# EAGLE design bib (EAGLE 7.0.0)
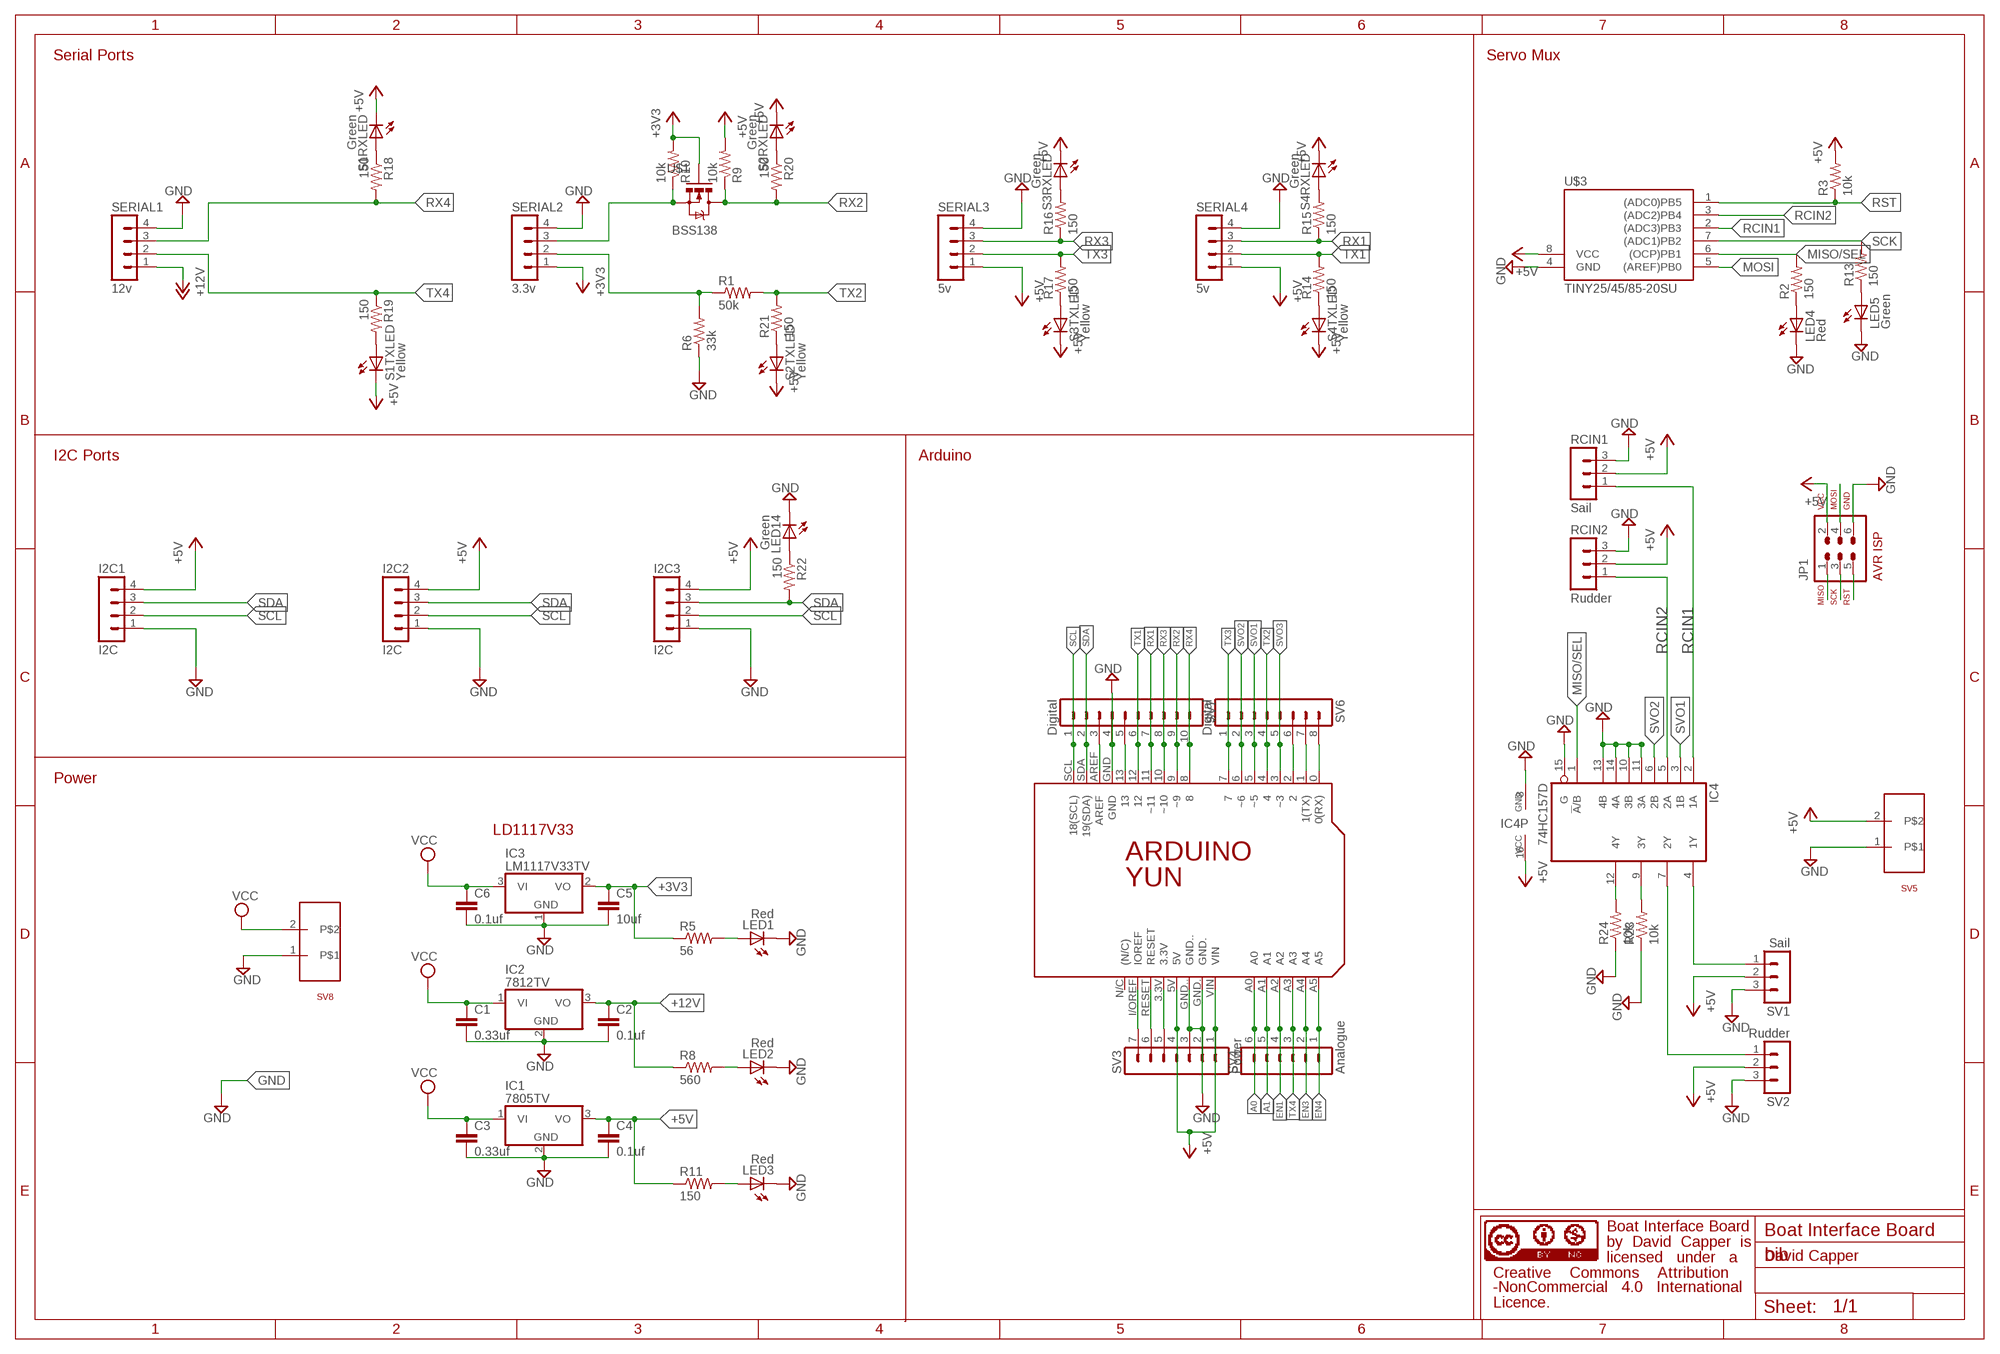
[diagram p0: schematic, sheet 1]

## Parts
C1  0.33uf  C-EUC0805K  [C0805K]
C2  0.1uf  C-EUC0805K  [C0805K]
C3  0.33uf  C-EUC0805K  [C0805K]
C4  0.1uf  C-EUC0805K  [C0805K]
C5  10uf  C-EUC0805K  [C0805K]
C6  0.1uf  C-EUC0805K  [C0805K]
I2C1  I2C  MA04-1  [MA04-1]
I2C2  I2C  MA04-1  [MA04-1]
I2C3  I2C  MA04-1  [MA04-1]
IC1  7805TV  [TO220V]
IC2  7812TV  [TO220V]
IC3  LM1117V33TV  [TO220V]
IC4  74HC157D  [SO16]
JP1  AVR-ISP-6VERT  [AVR-ISP-6]
LED1  Red  LEDSML1206  [SML1206]
LED2  Red  LEDSML1206  [SML1206]
LED3  Red  LEDSML1206  [SML1206]
LED4  Red  LEDSML1206  [SML1206]
LED5  Green  LEDSML1206  [SML1206]
LED14  Green  LEDSML1206  [SML1206]
PCB2  ARDUINO_YUNARDUINO_YUN  [ARDUINO_YUN]
R1  50k  R-US_M0805  [M0805]
R2  150  R-US_R0805  [R0805]
R3  10k  R-US_R0805  [R0805]
R5  56  R-US_R0805  [R0805]
R6  33k  R-US_M0805  [M0805]
R8  560  R-US_R0805  [R0805]
R9  10k  R-US_M0805  [M0805]
R10  10k  R-US_M0805  [M0805]
R11  150  R-US_R0805  [R0805]
R13  150  R-US_R0805  [R0805]
R14  150  R-US_R0805  [R0805]
R15  150  R-US_R0805  [R0805]
R16  150  R-US_R0805  [R0805]
R17  150  R-US_R0805  [R0805]
R18  150  R-US_R0805  [R0805]
R19  150  R-US_R0805  [R0805]
R20  150  R-US_R0805  [R0805]
R21  150  R-US_R0805  [R0805]
R22  150  R-US_R0805  [R0805]
R23  10k  R-US_R0805  [R0805]
R24  10k  R-US_R0805  [R0805]
RCIN1  Sail  MA03-1  [MA03-1]
RCIN2  Rudder  MA03-1  [MA03-1]
S1RXLED  Green  LEDSML1206  [SML1206]
S1TXLED  Yellow  LEDSML1206  [SML1206]
S2RXLED  Green  LEDSML1206  [SML1206]
S2TXLED  Yellow  LEDSML1206  [SML1206]
S3RXLED  Green  LEDSML1206  [SML1206]
S3TXLED  Yellow  LEDSML1206  [SML1206]
S4RXLED  Green  LEDSML1206  [SML1206]
S4TXLED  Yellow  LEDSML1206  [SML1206]
SERIAL1  12v  MA04-1  [MA04-1]
SERIAL2  3.3v  MA04-1  [MA04-1]
SERIAL3  5v  MA04-1  [MA04-1]
SERIAL4  5v  MA04-1  [MA04-1]
SV1  Sail  MA03-1  [MA03-1]
SV2  Rudder  MA03-1  [MA03-1]
SV3  Power  MA07-1  [MA07-1]
SV4  Analogue  MA06-1  [MA06-1]
SV5  MA02  [MA02-1]
SV6  Digital  MA08-1  [MA08-1]
SV7  Digital  MA10-1  [MA10-1]
SV8  MA02  [MA02-1]
U$1  BSS138  [SOT23]
U$3  TINY25/45/85-20SU  [SOIC8]

## Nets
+3V3: C5.1 IC3.2(VO) R5.1 R10.2 SERIAL2.1 U$1.1(G)
+5V: C4.1 I2C1.4 I2C2.4 I2C3.4 IC1.3(VO) IC4.16(VCC) JP1.2 PCB2.5V PCB2.VIN R3.2 R9.2 R11.1 RCIN1.2 RCIN2.2 S1RXLED.C S1TXLED.C S2RXLED.C S2TXLED.C S3RXLED.C S3TXLED.C S4RXLED.C S4TXLED.C SERIAL3.1 SERIAL4.1 SV1.2 SV2.2 SV3.1 SV3.4 SV5.2 U$3.8(VCC)
+12V: C2.1 IC2.3(VO) R8.1 SERIAL1.1
A0: PCB2.A0 SV4.6
A1: PCB2.A1 SV4.5
EN1: PCB2.A2 SV4.4
EN3: PCB2.A4 SV4.2
EN4: PCB2.A5 SV4.1
GND: C1.2 C2.2 C3.2 C4.2 C5.2 C6.2 I2C1.1 I2C2.1 I2C3.1 IC1.2(GND) IC2.2(GND) IC3.1(GND) IC4.8(GND) IC4.10(3B) IC4.11(3A) IC4.13(4B) IC4.14(4A) IC4.15(G) JP1.6 LED1.C LED2.C LED3.C LED4.C LED5.C LED14.C PCB2.GND PCB2.GND. PCB2.GND.. R6.1 R23.1 R24.1 RCIN1.3 RCIN2.3 SERIAL1.4 SERIAL2.4 SERIAL3.4 SERIAL4.4 SV1.3 SV2.3 SV3.2 SV3.3 SV5.1 SV7.4 SV8.1 U$3.4(GND)
MEH: PCB2.2 SV6.6
MISO/SEL: IC4.1(!A!/B) JP1.1 R2.2 U$3.6((OCP)PB1)
MOSI: JP1.4 U$3.5((AREF)PB0)
N$1: R10.1 SERIAL2.3 U$1.2(S)
N$2: LED4.A R2.1
N$3: IC4.12(4Y) R24.2
N$5: R1.1 R6.2 SERIAL2.2
N$7: IC4.4(1Y) SV1.1
N$8: IC4.7(2Y) SV2.1
N$9: PCB2.3.3V SV3.5
N$11: PCB2.RESET SV3.6
N$12: PCB2.I/OREF(IOREF) SV3.7
N$13: PCB2.1(1(TX)) SV6.7
N$14: PCB2.0(0(RX)) SV6.8
N$15: PCB2.AREF SV7.3
N$17: PCB2.13 SV7.5
N$20: IC4.9(3Y) R23.2
N$21: LED1.A R5.2
N$22: LED2.A R8.2
N$23: LED3.A R11.2
N$24: R18.1 S1RXLED.A
N$25: R19.2 S1TXLED.A
N$26: R20.1 S2RXLED.A
N$27: R21.1 S2TXLED.A
N$28: LED14.A R22.1
N$29: R15.2 S4RXLED.A
N$30: R14.1 S4TXLED.A
N$31: R16.2 S3RXLED.A
N$32: R17.1 S3TXLED.A
N$34: LED5.A R13.1
RCIN1: IC4.2(1A) RCIN1.1 U$3.2((ADC3)PB3)
RCIN2: IC4.5(2A) RCIN2.1 U$3.3((ADC2)PB4)
RST: JP1.5 R3.1 U$3.1((ADC0)PB5)
RX1: PCB2.11(~11) R15.1 SERIAL4.3 SV7.7
RX2: PCB2.9(~9) R9.1 R20.2 SV7.9 U$1.3(D)
RX3: PCB2.10(~10) R16.1 SERIAL3.3 SV7.8
RX4: PCB2.8 R18.2 SERIAL1.3 SV7.10
SCK: JP1.3 R13.2 U$3.7((ADC1)PB2)
SCL: I2C1.2 I2C2.2 I2C3.2 PCB2.SCL(18(SCL)) SV7.1
SDA: I2C1.3 I2C2.3 I2C3.3 PCB2.SDA(19(SDA)) R22.2 SV7.2
SVO1: IC4.3(1B) PCB2.5(~5) SV6.3
SVO2: IC4.6(2B) PCB2.6(~6) SV6.2
SVO3: PCB2.3(~3) SV6.5
TX1: PCB2.12 R14.2 SERIAL4.2 SV7.6
TX2: PCB2.4 R1.2 R21.2 SV6.4
TX3: PCB2.7 R17.2 SERIAL3.2 SV6.1
TX4: PCB2.A3 R19.1 SERIAL1.2 SV4.3
VCC: C1.1 C3.1 C6.1 IC1.1(VI) IC2.1(VI) IC3.3(VI) SV8.2
Unconnected: PCB2.N/C((N/C))

## Notes on the sheet
- Serial Ports | Servo Mux
- I2C Ports | Arduino
- Power
- LD1117V33
- Boat Interface Board
- Boat Interface Board
- by  David  Capper  is
- licensed   under   a | David Capper
- Creative    Commons    Attribution
- -NonCommercial   4.0   International
- Licence.

## Library data of the parts
C1 C3 = resistor:C-EU: CAPACITOR, European symbol; MF: AVX; MPN: 08053C334KAT2A; OC_FARNELL: 1833878
C2 C4 C6 = resistor:C-EU: CAPACITOR, European symbol; MF: AVX; MPN: 08051C104JAT2A; OC_FARNELL: 2332715RL
C5 = resistor:C-EU: CAPACITOR, European symbol; MF: YAGEO (PHYCOMP); MPN: CC0805KRX7R8BB333; OC_FARNELL: 3019822
I2C1-I2C3 SERIAL1-SERIAL4 = my_lib:MA04-1: PIN HEADER; OC_FARNELL: unknown; OC_NEWARK: unknown
IC1 = linear:78*: Positive VOLTAGE REGULATOR Source: http://cache.national.com/ds/LM/LM78L05.pdf http://www.fairchildsemi.com/ds/LM/LM7805.pdf; MF: STMICROELECTRONICS; MPN: L7805ACV; OC_FARNELL: 1087086
IC2 = linear:78*: Positive VOLTAGE REGULATOR Source: http://cache.national.com/ds/LM/LM78L05.pdf http://www.fairchildsemi.com/ds/LM/LM7805.pdf; MF: STMICROELECTRONICS; MPN: L7812ACV; OC_FARNELL: 1087091
IC3 = my_lib:LM1117V33: Positive VOLTAGE REGULATOR Source: http://cache.national.com/ds/LM/LM78L05.pdf http://www.fairchildsemi.com/ds/LM/LM7805.pdf; MF: STMICROELECTRONICS; MPN: LD1117V33; OC_FARNELL: 9755837
IC4 = my_lib:74*157: Quadruple 2-line to 1-line data SELECTOR/MULTIPLEXER; MF: TEXAS INSTRUMENTS; MPN: SN74HC157D; OC_FARNELL: 9591150
JP1 = avr-7:AVR-ISP-6: AVR ISP-6 Serial Programming Header
LED1-LED3 = led:LED: LED OSRAM: - CHIPLED LG R971, LG N971, LY N971, LG Q971, LY Q971, LO R971, LY R971 LH N974, LH R974 LS Q976, LO Q976, LY Q976 LO Q996 - Hyper CHIPLED LW Q18S LB Q993, LB Q99A, LB R99A - SideLED LS A670, LO A670, LY A670, LG A670, LP A670 LB A673, LV A673, LT A673, LW A673 LH A674 LY A675 LS A676, LA A676, LO A676, LY A676, LW A676 LS A679, LY A679, LG A679 - Hyper Micro SIDELED® LS Y876, LA Y876, LO Y876, LY Y876 LT Y87S - SmartLED LW L88C, LW L88S LB L89C, LB L89S, LG L890 LS L89K, LO L89K, LY L89K LS L896, LA L896, LO L896, LY L896 - TOPLED LS T670, LO T670, LY T670, LG T670, LP T670 LSG T670, LSP T670, LSY T670, LOP T670, LYG T670 LG T671, LOG T671, LSG T671 LB T673, LV T673, LT T673, LW T673 LH T674 LS T676, LA T676, LO T676, LY T676, LB T676, LH T676, LSB T676, LW T676 LB T67C, LV T67C, LT T67C, LS T67K, LO T67K, LY T67K, LW E67C LS E67B, LA E67B, LO E67B, LY E67B, LB E67C, LV E67C, LT E67C LW T67C LS T679, LY T679, LG T679 LS T770, LO T770, LY T770, LG T770, LP T770 LB T773, LV T773, LT T773, LW T773 LH T774 LS E675, LA E675, LY E675, LS T675 LS T776, LA T776, LO T776, LY T776, LB T776 LHGB T686 LT T68C, LB T68C - Hyper Mini TOPLED® LB M676 - Mini TOPLED Santana® LG M470 LS M47K, LO M47K, LY M47K Source: http://www.osram.convergy.de LUXEON: - LUMILED® LXK2-PW12-R00, LXK2-PW12-S00, LXK2-PW14-U00, LXK2-PW14-V00 LXK2-PM12-R00, LXK2-PM12-S00, LXK2-PM14-U00 LXK2-PE12-Q00, LXK2-PE12-R00, LXK2-PE12-S00, LXK2-PE14-T00, LXK2-PE14-U00 LXK2-PB12-K00, LXK2-PB12-L00, LXK2-PB12-M00, LXK2-PB14-N00, LXK2-PB14-P00, LXK2-PB14-Q00 LXK2-PR12-L00, LXK2-PR12-M00, LXK2-PR14-Q00, LXK2-PR14-R00 LXK2-PD12-Q00, LXK2-PD12-R00, LXK2-PD12-S00 LXK2-PH12-R00, LXK2-PH12-S00 LXK2-PL12-P00, LXK2-PL12-Q00, LXK2-PL12-R00 Source: www.luxeon.com KINGBRIGHT: KA-3528ASYC Source: www.kingbright.com; MF: KINGBRIGHT; MPN: KPT-3216SRC-J4; OC_FARNELL: 2314403
LED4 LED5 LED14 S1RXLED S2RXLED S3RXLED S4RXLED = led:LED: LED OSRAM: - CHIPLED LG R971, LG N971, LY N971, LG Q971, LY Q971, LO R971, LY R971 LH N974, LH R974 LS Q976, LO Q976, LY Q976 LO Q996 - Hyper CHIPLED LW Q18S LB Q993, LB Q99A, LB R99A - SideLED LS A670, LO A670, LY A670, LG A670, LP A670 LB A673, LV A673, LT A673, LW A673 LH A674 LY A675 LS A676, LA A676, LO A676, LY A676, LW A676 LS A679, LY A679, LG A679 - Hyper Micro SIDELED® LS Y876, LA Y876, LO Y876, LY Y876 LT Y87S - SmartLED LW L88C, LW L88S LB L89C, LB L89S, LG L890 LS L89K, LO L89K, LY L89K LS L896, LA L896, LO L896, LY L896 - TOPLED LS T670, LO T670, LY T670, LG T670, LP T670 LSG T670, LSP T670, LSY T670, LOP T670, LYG T670 LG T671, LOG T671, LSG T671 LB T673, LV T673, LT T673, LW T673 LH T674 LS T676, LA T676, LO T676, LY T676, LB T676, LH T676, LSB T676, LW T676 LB T67C, LV T67C, LT T67C, LS T67K, LO T67K, LY T67K, LW E67C LS E67B, LA E67B, LO E67B, LY E67B, LB E67C, LV E67C, LT E67C LW T67C LS T679, LY T679, LG T679 LS T770, LO T770, LY T770, LG T770, LP T770 LB T773, LV T773, LT T773, LW T773 LH T774 LS E675, LA E675, LY E675, LS T675 LS T776, LA T776, LO T776, LY T776, LB T776 LHGB T686 LT T68C, LB T68C - Hyper Mini TOPLED® LB M676 - Mini TOPLED Santana® LG M470 LS M47K, LO M47K, LY M47K Source: http://www.osram.convergy.de LUXEON: - LUMILED® LXK2-PW12-R00, LXK2-PW12-S00, LXK2-PW14-U00, LXK2-PW14-V00 LXK2-PM12-R00, LXK2-PM12-S00, LXK2-PM14-U00 LXK2-PE12-Q00, LXK2-PE12-R00, LXK2-PE12-S00, LXK2-PE14-T00, LXK2-PE14-U00 LXK2-PB12-K00, LXK2-PB12-L00, LXK2-PB12-M00, LXK2-PB14-N00, LXK2-PB14-P00, LXK2-PB14-Q00 LXK2-PR12-L00, LXK2-PR12-M00, LXK2-PR14-Q00, LXK2-PR14-R00 LXK2-PD12-Q00, LXK2-PD12-R00, LXK2-PD12-S00 LXK2-PH12-R00, LXK2-PH12-S00 LXK2-PL12-P00, LXK2-PL12-Q00, LXK2-PL12-R00 Source: www.luxeon.com KINGBRIGHT: KA-3528ASYC Source: www.kingbright.com; MF: KINGBRIGHT; MPN: KPT-3216SGC; OC_FARNELL: 2099247RL
PCB2 = my_lib:ARDUINO_YUN: Device for representing an Arduino Leonardo board with a footprint in an EAGLE design. Created by Dave Young for Element14. More EAGLE documentation at: http://www.element14.com/community/community/knode/cadsoft_eagle; OC_FARNELL: unknown
R1 = resistor:R-US_: RESISTOR, American symbol; MF: VISHAY DRALORIC; MPN: CRCW080533K0FKEA; OC_FARNELL: 1652985RL
R2 R3 R11 R13-R22 = resistor:R-US_: RESISTOR, American symbol; MF: VISHAY DRALORIC; MPN: CRCW0805150RFKEAHP; OC_FARNELL: 1738948RL
R5 = resistor:R-US_: RESISTOR, American symbol; MF: VISHAY DRALORIC; MPN: CRCW080556R0FKEAHP; OC_FARNELL: 1738943
R6 = resistor:R-US_: RESISTOR, American symbol; MF: VISHAY DRALORIC; MPN: CRCW080549K9FKEA; OC_FARNELL: 1469934
R8 = resistor:R-US_: RESISTOR, American symbol; MF: VISHAY DRALORIC; MPN: CRCW0805560RFKEAHP; OC_FARNELL: 1738956
R9 R10 R23 R24 = resistor:R-US_: RESISTOR, American symbol; MF: VISHAY DRALORIC; MPN: CRCW080510K0FKEA; OC_FARNELL: 1469856
RCIN1 RCIN2 SV1 SV2 = my_lib:MA03-1: PIN HEADER; OC_FARNELL: unknown; OC_NEWARK: unknown
S1TXLED S2TXLED S3TXLED S4TXLED = led:LED: LED OSRAM: - CHIPLED LG R971, LG N971, LY N971, LG Q971, LY Q971, LO R971, LY R971 LH N974, LH R974 LS Q976, LO Q976, LY Q976 LO Q996 - Hyper CHIPLED LW Q18S LB Q993, LB Q99A, LB R99A - SideLED LS A670, LO A670, LY A670, LG A670, LP A670 LB A673, LV A673, LT A673, LW A673 LH A674 LY A675 LS A676, LA A676, LO A676, LY A676, LW A676 LS A679, LY A679, LG A679 - Hyper Micro SIDELED® LS Y876, LA Y876, LO Y876, LY Y876 LT Y87S - SmartLED LW L88C, LW L88S LB L89C, LB L89S, LG L890 LS L89K, LO L89K, LY L89K LS L896, LA L896, LO L896, LY L896 - TOPLED LS T670, LO T670, LY T670, LG T670, LP T670 LSG T670, LSP T670, LSY T670, LOP T670, LYG T670 LG T671, LOG T671, LSG T671 LB T673, LV T673, LT T673, LW T673 LH T674 LS T676, LA T676, LO T676, LY T676, LB T676, LH T676, LSB T676, LW T676 LB T67C, LV T67C, LT T67C, LS T67K, LO T67K, LY T67K, LW E67C LS E67B, LA E67B, LO E67B, LY E67B, LB E67C, LV E67C, LT E67C LW T67C LS T679, LY T679, LG T679 LS T770, LO T770, LY T770, LG T770, LP T770 LB T773, LV T773, LT T773, LW T773 LH T774 LS E675, LA E675, LY E675, LS T675 LS T776, LA T776, LO T776, LY T776, LB T776 LHGB T686 LT T68C, LB T68C - Hyper Mini TOPLED® LB M676 - Mini TOPLED Santana® LG M470 LS M47K, LO M47K, LY M47K Source: http://www.osram.convergy.de LUXEON: - LUMILED® LXK2-PW12-R00, LXK2-PW12-S00, LXK2-PW14-U00, LXK2-PW14-V00 LXK2-PM12-R00, LXK2-PM12-S00, LXK2-PM14-U00 LXK2-PE12-Q00, LXK2-PE12-R00, LXK2-PE12-S00, LXK2-PE14-T00, LXK2-PE14-U00 LXK2-PB12-K00, LXK2-PB12-L00, LXK2-PB12-M00, LXK2-PB14-N00, LXK2-PB14-P00, LXK2-PB14-Q00 LXK2-PR12-L00, LXK2-PR12-M00, LXK2-PR14-Q00, LXK2-PR14-R00 LXK2-PD12-Q00, LXK2-PD12-R00, LXK2-PD12-S00 LXK2-PH12-R00, LXK2-PH12-S00 LXK2-PL12-P00, LXK2-PL12-Q00, LXK2-PL12-R00 Source: www.luxeon.com KINGBRIGHT: KA-3528ASYC Source: www.kingbright.com; MF: KINGBRIGHT; MPN: KPT-3216SYCK; OC_FARNELL: 2099249
SV3 = my_lib:MA07-1: PIN HEADER; OC_FARNELL: unknown; OC_NEWARK: unknown
SV4 = my_lib:MA06-1: PIN HEADER; OC_FARNELL: unknown; OC_NEWARK: unknown
SV5 SV8 = my_lib:MA02: PIN HEADER; OC_FARNELL: unknown
SV6 = my_lib:MA08-1: PIN HEADER; OC_FARNELL: unknown; OC_NEWARK: unknown
SV7 = my_lib:MA10-1: PIN HEADER; OC_FARNELL: unknown; OC_NEWARK: unknown
U$1 = my_lib:BSS138; MF: FAIRCHILD SEMICONDUCTOR; MPN: BSS138; OC_FARNELL: 9845330RL
U$3 = my_lib:TINY25/45/85; MF: ATMEL; MPN: ATTINY25-20SU; OC_FARNELL: 1455143

## Board
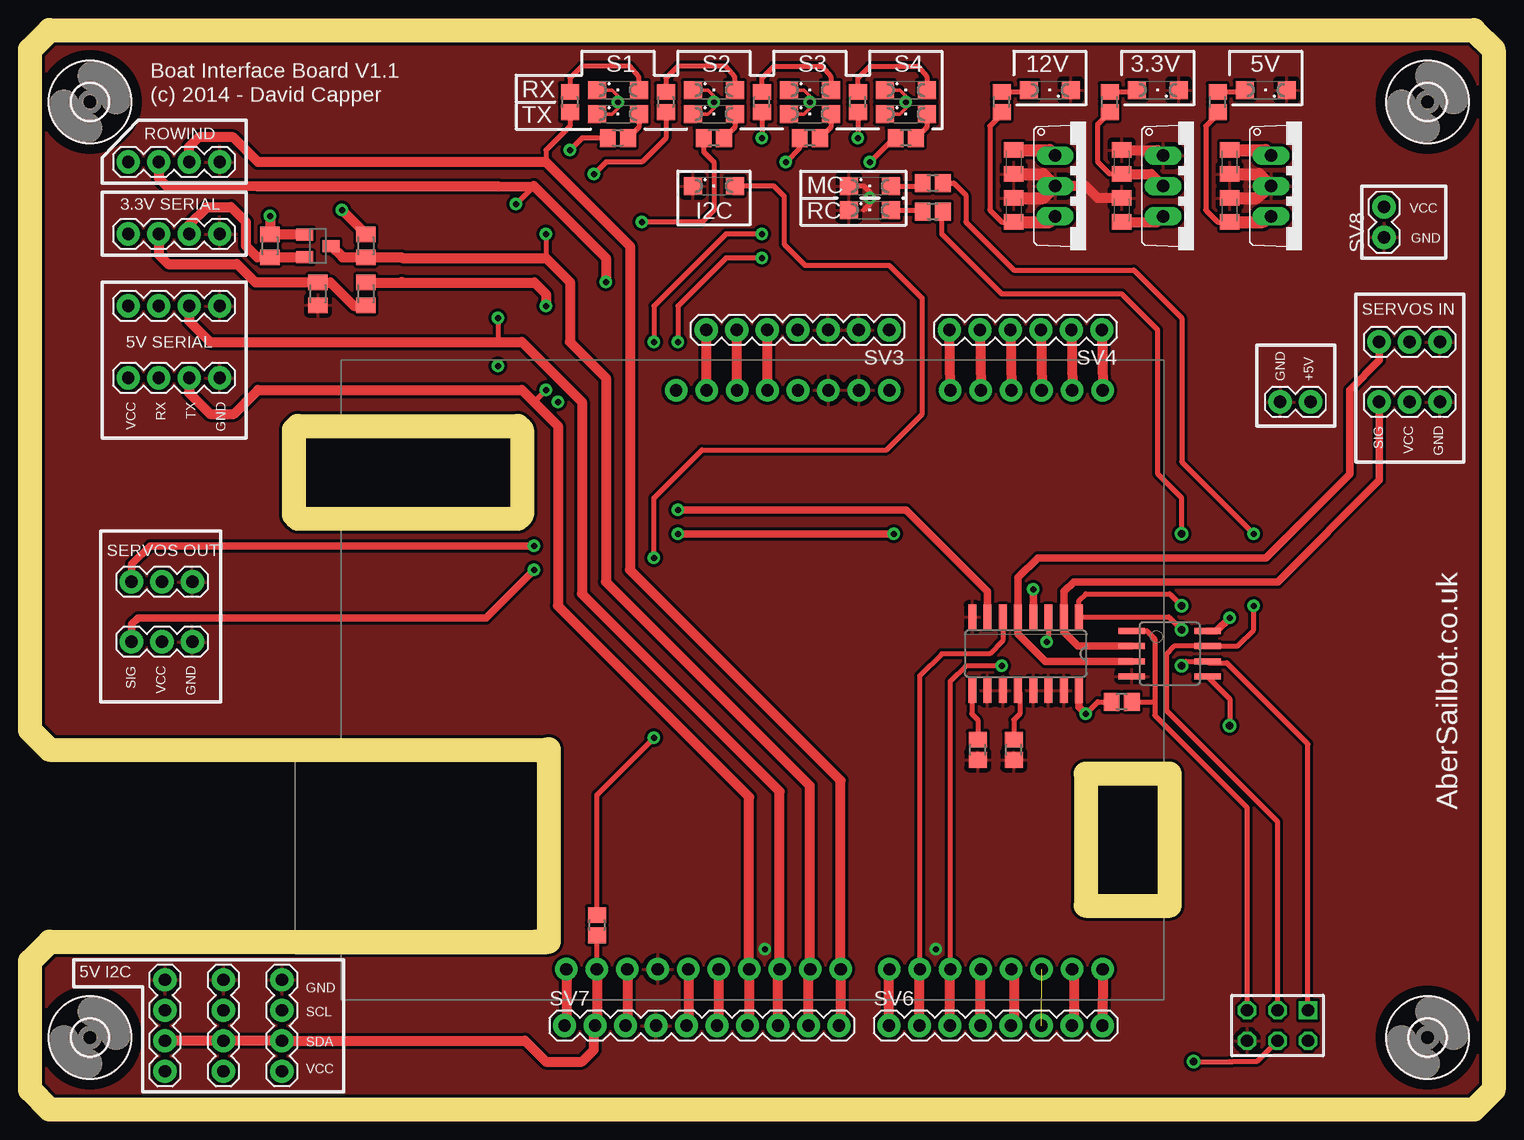
[diagram p1: board, top side]
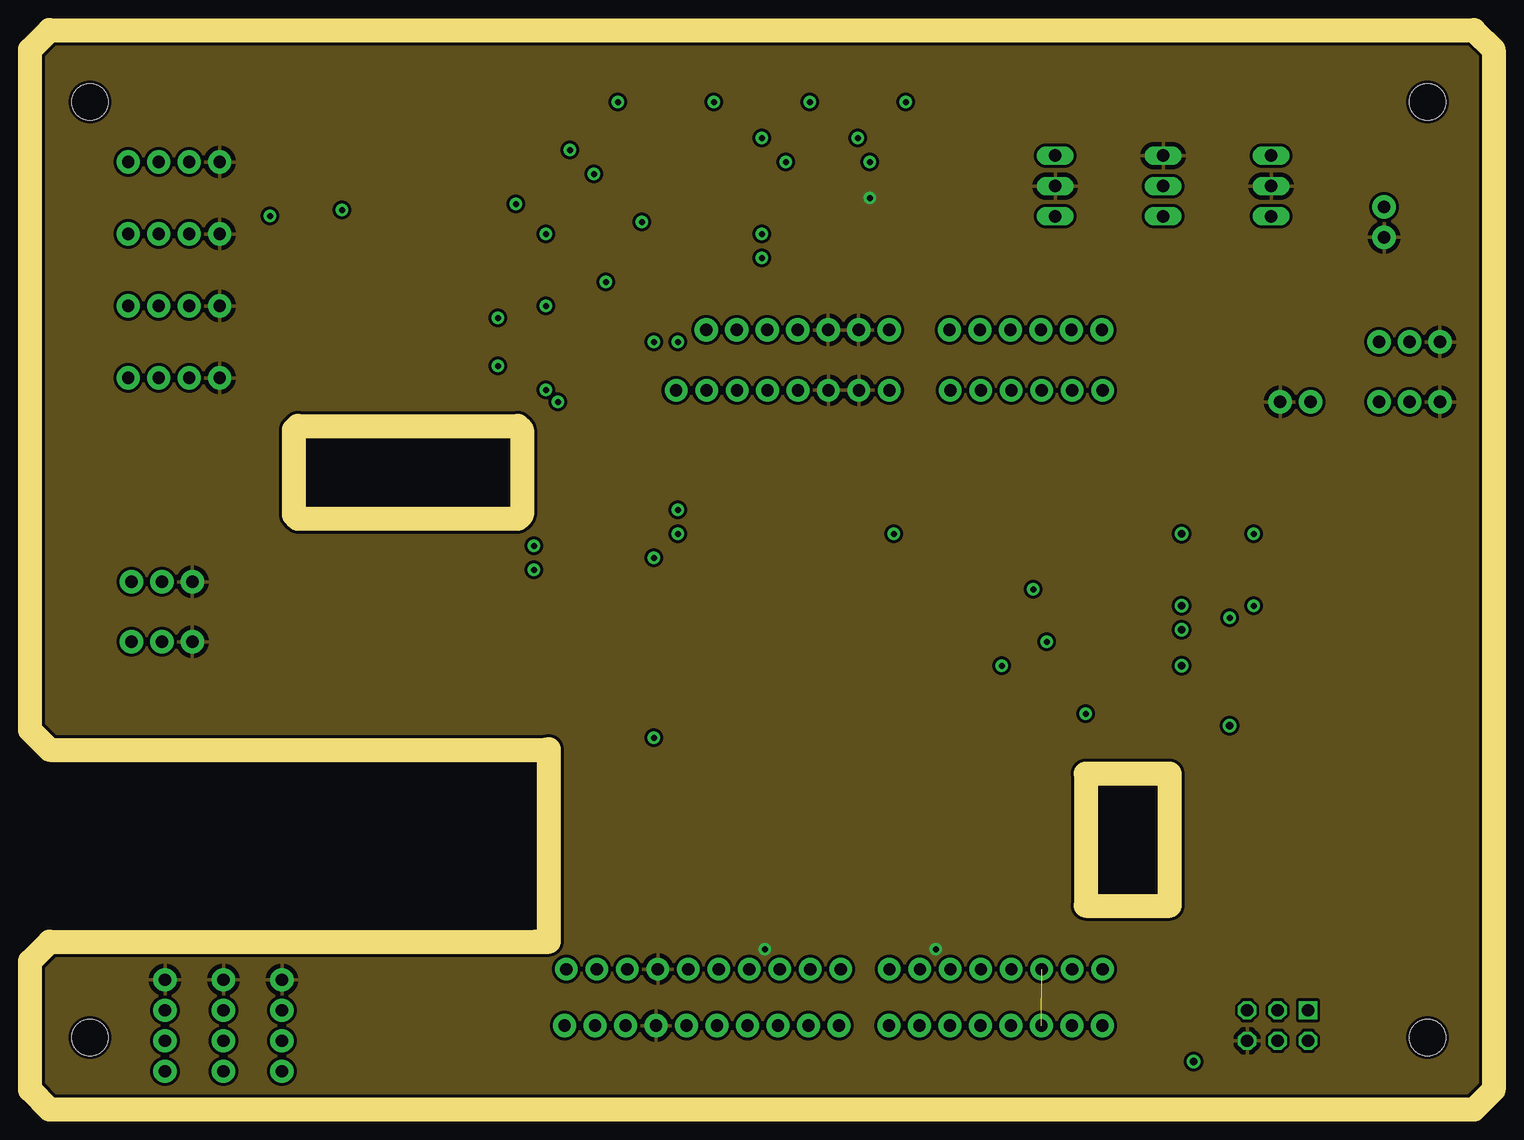
[diagram p2: board, inner layer gnd]
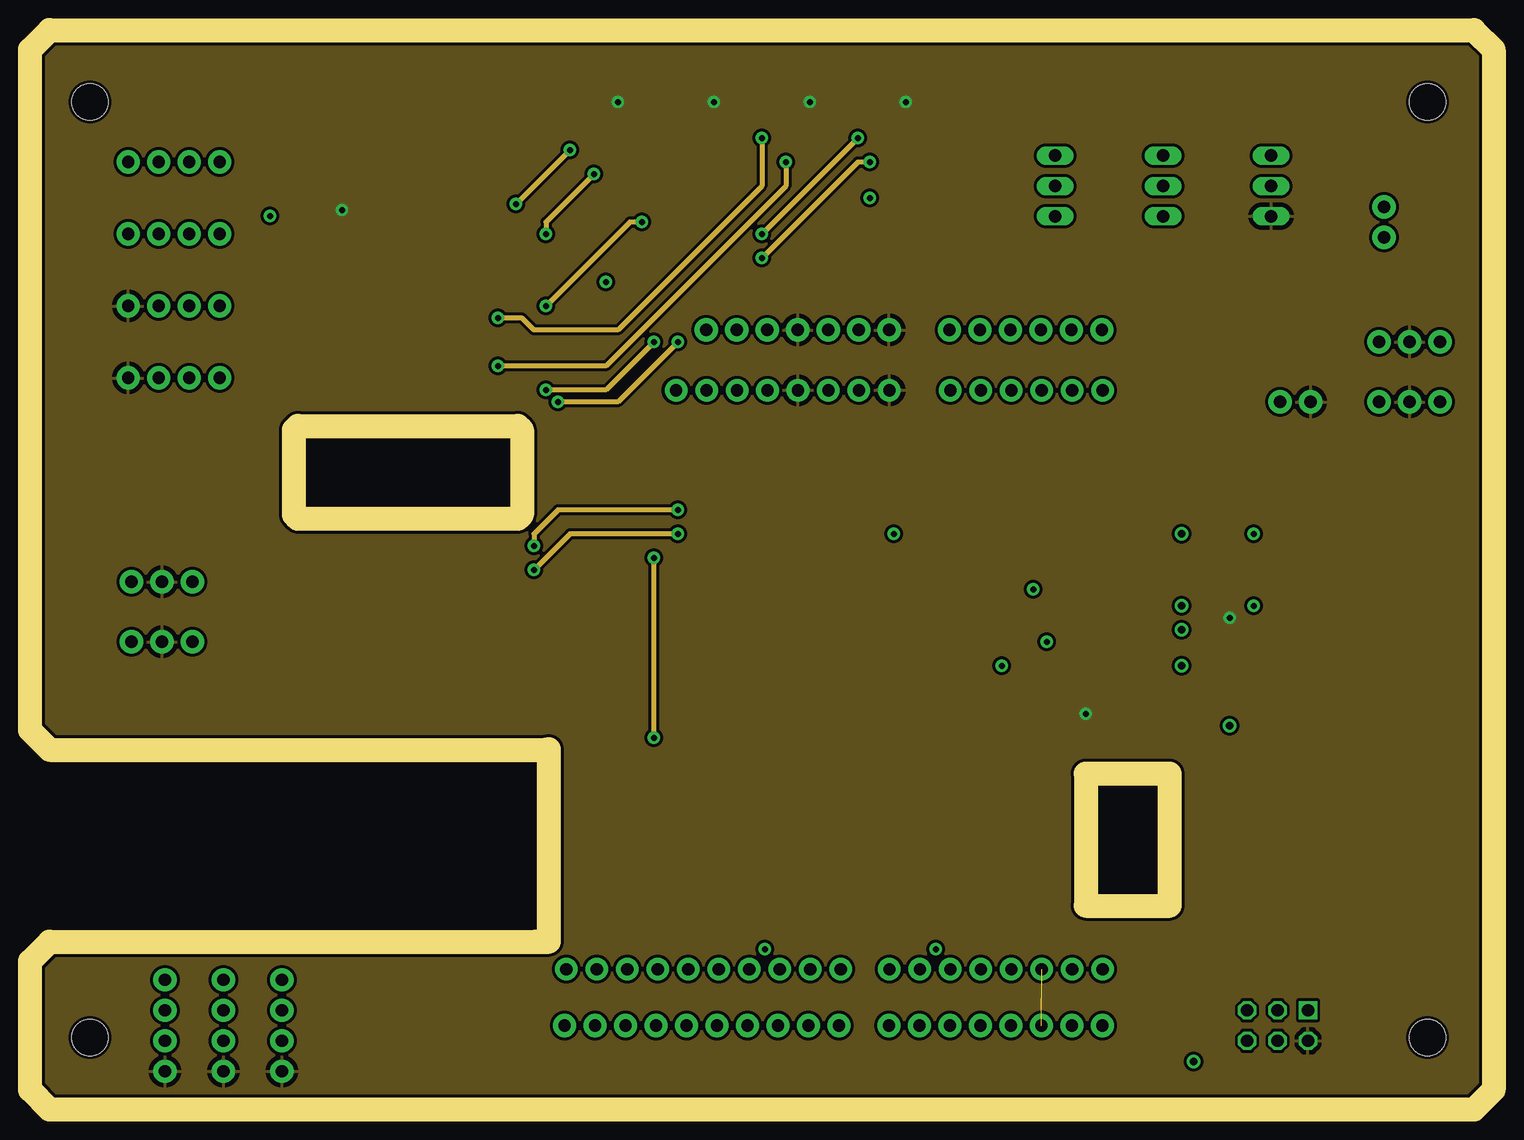
[diagram p3: board, inner layer 5v]
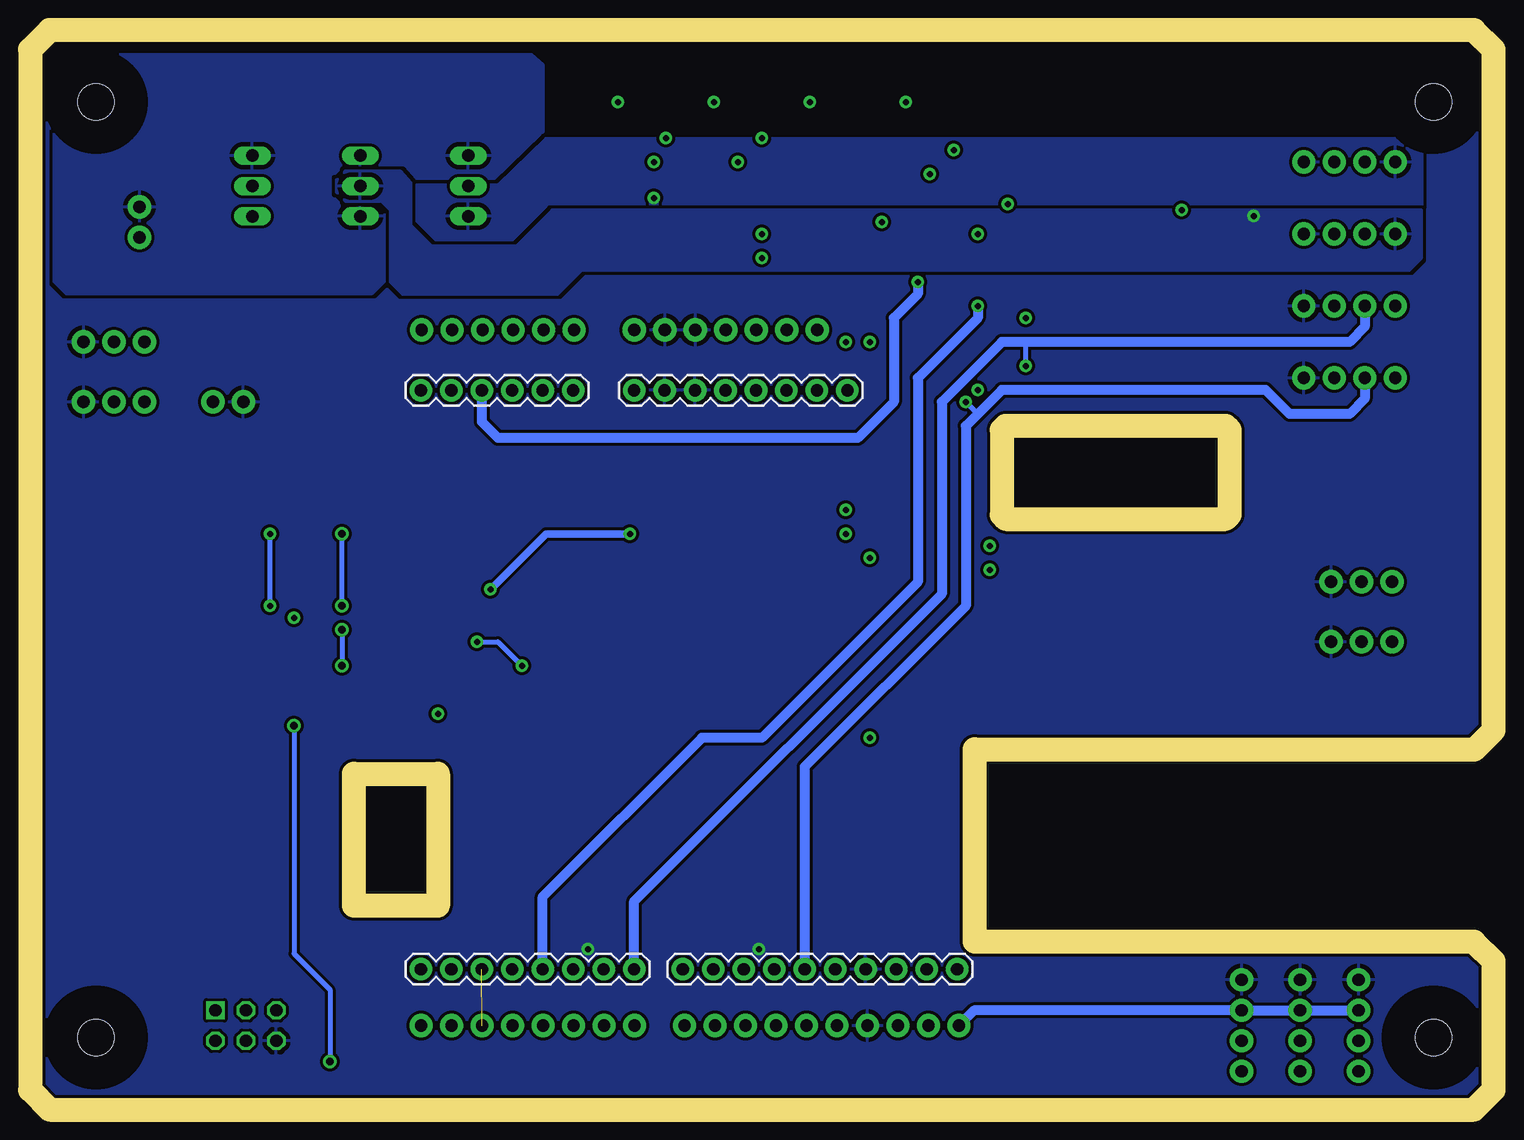
[diagram p4: board, bottom side, seen from below]

Size 122 x 90 mm. Coordinates in mm from the lower left corner, seen from the top.
Outline: 43.25,14.44 43.25,30.06 42.18,30.25
Outline: 42.18,14 1.63,14 0,12.36 0,1.63 1.63,0 120.36,0 122,1.63 122,88.36 120.36,90 1.63,90 0,88.36 0,31.62 1.62,30 43,30
Outline: 42.18,14 43.25,14.44
Outline: 42.18,14 43.25,14 43.25,14.44
Outline: 22.32,57 40.68,57 41,56.68 41,49.57 40.68,49.25 22.32,49.25 22,49.57 22,56.68 22.32,57
Outline: 95,28 88,28 88,17 95,17 95,28
Copper layers (1*2*15*16): Top 0.035mm / dielectric 1.5mm / gnd 0.035mm / dielectric 0.15mm / 5v 0.035mm / dielectric 0.2mm / 12/3v/sig(bottom) 0.035mm
Design rules "pcbtrain *": minimum track width 0.2mm, minimum drill 0.4mm, track to track 0.25mm, track to pad 0.25mm, pad to pad 0.25mm, via to via 0.25mm, smd to smd 0mil, copper to edge 10mil, drill to drill 0.2mm, minimum pad ring 10mil, minimum via ring 10mil, stop-mask expansion 0.125mm, vias tented up to drill 0.5mm, thermal gap 15mil

### Footprints (pad centres in the part's own frame; a part is rotated, then mirrored left to right if it is on the bottom)
C0805K = smd 1.3 x 1.6: 1 -1,0; 2 1,0
MA04-1 = drill 1.016 pad 1.93: 1 -3.81,0; 2 -1.27,0; 3 1.27,0; 4 3.81,0
TO220V = drill 1.016 long: 1 -2.54,-2.54; 2 0,-2.54; 3 2.54,-2.54
SO16 = smd 0.66 x 2.032: 1 -4.445,-3.073; 2 -3.175,-3.073; 3 -1.905,-3.073; 4 -0.635,-3.073; 5 0.635,-3.073; 6 1.905,-3.073; 7 3.175,-3.073; 8 4.445,-3.073; 9 4.445,3.073; 10 3.175,3.073; 11 1.905,3.073; 12 0.635,3.073; 13 -0.635,3.073; 14 -1.905,3.073; 15 -3.175,3.073; 16 -4.445,3.073
AVR-ISP-6 = drill 1.016 square: 1 -2.54,-1.27 | drill 1.016 octagon: 2 -2.54,1.27; 3 0,-1.27; 4 0,1.27; 5 2.54,-1.27; 6 2.54,1.27
SML1206 = smd 1.5 x 1.5: A 1.75,0; C -1.75,0
ARDUINO_YUN = drill 1.016 pad 1.88: 0 5.08,50.8; 1 7.62,50.8; 2 10.16,50.8; 3 12.7,50.8; 3.3V 33.02,2.54; 4 15.24,50.8; 5 17.78,50.8; 5V 30.48,2.54; 6 20.32,50.8; 7 22.86,50.8; 8 26.924,50.8; 9 29.464,50.8; 10 32.004,50.8; 11 34.544,50.8; 12 37.084,50.8; 13 39.624,50.8; A0 17.78,2.54; A1 15.24,2.54; A2 12.7,2.54; A3 10.16,2.54; A4 7.62,2.54; A5 5.08,2.54; AREF 44.704,50.8; GND 42.164,50.8; GND. 25.4,2.54; GND.. 27.94,2.54; I/OREF 38.1,2.54; N/C 40.64,2.54; RESET 35.56,2.54; SCL 49.784,50.8; SDA 47.244,50.8; VIN 22.86,2.54
M0805 = smd 1.3 x 1.6: 1 -0.95,0; 2 0.95,0
R0805 = smd 1.3 x 1.5: 1 -0.85,0; 2 0.85,0
MA03-1 = drill 1.016 pad 1.93: 1 -2.54,0; 2 0,0; 3 2.54,0
MA07-1 = drill 1.016 pad 1.93: 1 -7.62,0; 2 -5.08,0; 3 -2.54,0; 4 0,0; 5 2.54,0; 6 5.08,0; 7 7.62,0
MA06-1 = drill 1.016 pad 1.93: 1 -6.35,0; 2 -3.81,0; 3 -1.27,0; 4 1.27,0; 5 3.81,0; 6 6.35,0
MA02-1 = drill 1.016 pad 1.93: 1 -2.54,0; 2 0,0
MA08-1 = drill 1.016 pad 1.93: 1 -8.89,0; 2 -6.35,0; 3 -3.81,0; 4 -1.27,0; 5 1.27,0; 6 3.81,0; 7 6.35,0; 8 8.89,0
MA10-1 = drill 1.016 pad 1.93: 1 -11.43,0; 2 -8.89,0; 3 -6.35,0; 4 -3.81,0; 5 -1.27,0; 6 1.27,0; 7 3.81,0; 8 6.35,0; 9 8.89,0; 10 11.43,0
SOT23 = smd 1 x 1.4: 1 -0.95,-1.1; 2 0.95,-1.1; 3 0,1.1
3,0 = hole 3: 0,0
SOIC8 = smd 0.5 x 2.2: 1 -1.905,-3.154; 2 -0.645,-3.154; 3 0.625,-3.154; 4 1.895,-3.154; 5 1.905,3.154; 6 0.635,3.154; 7 -0.635,3.154; 8 -1.905,3.154

### Placement (x,y rotation side)
C1  91,75 90 top
C2  82,75 90 top
C3  82,79 270 top
C4  100,75 90 top
C5  91,79 90 top
C6  100,79 270 top
I2C1  11.25,7 270 top
I2C2  16.12,7 270 top
I2C3  21,7 270 top
IC1  106,77 270 top
IC2  88,77 270 top
IC3  97,77 270 top
IC4  83,38 180 top
JP1  104,7 180 top
LED1  94,85 180 top
LED2  85,85 180 top
LED3  103,85 180 top
LED4  70,75 0 top
LED5  70,77 0 top
LED14  57,77 0 top
PCB2  94.5,62.5 180 top
R1  28,68 90 top
R2  75.25,74.88 0 top
R3  91,34 180 top
R5  90,84 90 top
R6  24,68 90 top
R8  81,84 90 top
R9  28,72 90 top
R10  20,72 90 top
R11  99,84 90 top
R13  75.25,77.25 0 top
R14  73,81 180 top
R15  69,84 90 top
R16  61,84 90 top
R17  65,81 180 top
R18  45,84 270 top
R19  49,81 0 top
R20  53,84 270 top
R21  57,81 180 top
R22  47.25,15.38 270 top
R23  79,30 90 top
R24  82,30 90 top
RCIN1  115,59 0 top
RCIN2  115,64 0 top
S1RXLED  49,85 0 top
S1TXLED  49,83 0 top
S2RXLED  57,85 0 top
S2TXLED  57,83 0 top
S3RXLED  65,85 0 top
S3TXLED  65,83 0 top
S4RXLED  73,85 0 top
S4TXLED  73,83 0 top
SERIAL1  12,79 0 top
SERIAL2  12,73 0 top
SERIAL3  12,67 0 top
SERIAL4  12,61 0 top
SV1  11,39 0 top
SV2  11,44 0 top
SV3  64,65 180 top
SV4  83,65 180 top
SV5  106.75,59 0 top
SV6  80.5,7 0 top
SV7  56,7 0 top
SV8  112.88,75.25 90 top
U$1  24,72 270 top
U$2  [3,0]  116.5,84 0 top
U$3  95,38 270 top
U$4  [3,0]  116.5,6 0 top
U$5  [3,0]  5,6 0 top
U$6  [3,0]  5,84 0 top

### Tracks (layer width: path | path; a pad name or v marks a point on that pad's centre or on a via)
+3V3  (via drill 0.5)
  Top 0.406: C5.1 90,78 89,79 89,82.15 R5.1
  Top 0.813: U$1.1 R10.2 v20,74.5 | C5.1 93.46,78 IC3.2
  pour 12/3v/sig(bottom) (isolate 0.254): 6,75 78.5,75 81.5,72 88.5,72 90.25,73.75 90.25,77.25 91.12,78.25 95.75,78.25 96.5,77.5 96.5,76.5 95.75,75.75 92.75,75.75 92,75 92,69 91,68 78,68 76,70 7,70 6,71
+5V  (via drill 0.5)
  Top 0.305: S1RXLED.C 48.5,85 49,84.5 v49,84 49,83.5 48.5,83 S1TXLED.C | S2RXLED.C 56.5,85 57,84.5 v57,84 57,83.5 56.5,83 S2TXLED.C | S3RXLED.C 64.5,85 65,84.5 v65,84 65,83.5 64.5,83 S3TXLED.C | S4RXLED.C 72.5,85 73,84.5 v73,84 73,83.5 72.5,83 S4TXLED.C
  Top 0.406: R11.1 99,83 98,82 98,75 99,74 C4.1 | v88,33 89,34 R3.2
  Top 0.61: U$3.8 98.91,39.91 v100,41 | IC4.16 87.44,33.55 v88,33
  Top 0.813: R9.2 28,73 v26,75
  Top 1.016: C4.1 102.75,74 IC1.3
  pour 5v (isolate 0.254): 2,90 0,88 0,33 3,30 42,30 42,14 3,14 0,12 0,1.32 2.32,0 120,0 122,2 122,87.68 119.68,90
+12V
  Top 0.406: R8.1 81,83 80,82 80,75 81,74 C2.1
  Top 1.016: C2.1 85,74 IC2.3
  pour 12/3v/sig(bottom) (isolate 0.254, rank 2): 6,75.38 78.75,75.5 81.75,72.5 88.25,72.5 89.75,74 89.75,77.12 83,77.12 79,81 7,81 6,80
A0
  Top 0.813: PCB2.A0 SV4.6
A1
  Top 0.813: SV4.5 PCB2.A1
EN1
  Top 0.813: SV4.4 PCB2.A2
EN3
  Top 0.813: SV4.2 PCB2.A4
EN4
  Top 0.813: SV4.1 PCB2.A5
GND  (via drill 0.5)
  Top 0.406: LED5.C 69.5,77 70,76.5 v70,76 70,75.5 69.5,75
  Top 0.813: C5.2 94,80 IC3.1 | C1.2 89,76 88,77 IC2.2
  Top 1.016: C6.2 102.46,78 IC1.2 102.21,76 C4.2 | C2.2 84.46,76 IC2.2 84.46,78 C3.2
  other vias: 61.25,13.38 75.5,13.38
  pour gnd (isolate 0.254): 2,90 120,90 122,88 122,2 120,0 2,0 0,1 0,12 2,14 42,14 42,30 3,30 0,33 0,88
  pour 12/3v/sig(bottom) (isolate 0.254, rank 6): 2,90 120,90 122,88 122,2 120,0 2,0 0,2 0,12 2,14 43,14 43,30 2,30 0,32 0,88
  pour Top (isolate 0.254): 2,90 120,90 122,88 122,2 120,0 2,0 0,2 0,12 2,14 43,14 43,30 2,30 0,32 0,88
MEH  (1 unrouted)
MISO/SEL  (via drill 0.6)
  Top 0.406: v96,40 94.93,41.07 IC4.1 87.44,42.45 88,43 95,43 v96,42 | v96,37 96.36,37.37 U$3.6 98.27,37.25 99.75,37.25 106.54,30.46 JP1.1 | v96,48 96,51 94,53 94,65 91,68 81,68 76,73 76,74.78 R2.2
  12/3v/sig(bottom) 0.406: v96,40 v96,37 | v96,42 v96,48
MOSI  (via drill 0.6)
  Top 0.406: U$3.5 100,34.25 v100,32 | v97,4 100,4 100.27,4 102.27,4 JP1.4
  12/3v/sig(bottom) 0.406: v100,32 100,13 97,10 v97,4
N$1
  Top 0.813: U$1.2 R10.1 18.95,71.05 18,72 18,74 16.75,75.25 14.75,75.25 13.27,73.77 SERIAL2.3
N$2
  Top 0.406: LED4.A 74.4,75 R2.1
N$3
  Top 0.406: IC4.12 82.5,34.79 82.5,33 82,32.5 R24.2
N$5
  Top 0.813: SERIAL2.2 10.73,71.27 11.5,70.5 17.25,70.5 18.8,68.95 R6.2 25.05,68.95 27,67 27.95,67 R1.1
N$6
  cutout Top: 22,57 22,49.25 41,49.25 41,57
N$7  (via drill 0.5)
  Top 0.61: IC4.4 83.62,41.31 v83.62,43.38 | v72,48 v54,48 | v42,45 38,41 9,41 8.46,40.46 SV1.1
  5v 0.406: v54,48 45,48 v42,45
  12/3v/sig(bottom) 0.61: v83.62,43.38 79,48 v72,48
N$8  (via drill 0.5)
  Top 0.61: IC4.7 79.83,43.17 73,50 v54,50 | v42,47 10,47 8.46,45.46 SV2.1
  5v 0.406: v54,50 44,50 42,48 v42,47
N$9
  Top 0.813: PCB2.3.3V SV3.5
N$11
  Top 0.813: PCB2.RESET SV3.6
N$12
  Top 0.813: PCB2.I/OREF SV3.7
N$13
  Top 0.813: PCB2.1 86.88,11.88 87,12 87,7.15 SV6.7
N$14
  Top 0.813: PCB2.0 SV6.8
N$15
  Top 0.813: PCB2.AREF 49.8,7.15 SV7.3
N$16
  cutout Top: 88,28 95,28 95,17 88,17
N$17
  Top 0.813: PCB2.13 54.88,7.15 SV7.5
N$18
  cutout 12/3v/sig(bottom): 88,28 95,28 95,17 88,17
N$19
  cutout 12/3v/sig(bottom): 22,49.25 22,57 41,57 41,49.25
N$20
  Top 0.406: IC4.9 78.5,34.87 78.5,33 79,32.5 R23.2
N$21
  Top 0.406: R5.2 92.1,84.85 LED1.A
N$22
  Top 0.406: R8.2 83.1,84.85 LED2.A
N$23
  Top 0.406: R11.2 101.1,84.85 LED3.A
N$24
  Top 0.406: S1RXLED.A 50.75,86.1 50,87 46,87 45,86 R18.1
N$25
  Top 0.406: S1TXLED.A 50.75,81.9 R19.2
N$26
  Top 0.406: S2RXLED.A 58.75,86.1 58,87 54,87 53,86 R20.1
N$27
  Top 0.406: S2TXLED.A 58.75,81.9 R21.1
N$28  (via drill 0.5)
  Top 0.406: R22.1 47.25,26.25 v52,31 | v52,46 52,51 56,55 71.38,55 74.38,58 74.38,67.62 71.62,70.38 64.62,70.38 62.88,72.12 62.88,76.12 62,77 LED14.A
  5v 0.406: v52,31 v52,46
N$29
  Top 0.406: R15.2 69,86 70,87 74,87 74.75,86.1 S4RXLED.A
N$30
  Top 0.406: S4TXLED.A 74.75,81.9 R14.1
N$31
  Top 0.406: R16.2 61,86 62,87 66,87 66.75,86.1 S3RXLED.A
N$32
  Top 0.406: S3TXLED.A 66.75,81.9 R17.1
N$34
  Top 0.406: LED5.A 74.15,77 R13.1
RCIN1
  Top 0.61: U$3.2 87.36,38.65 86.17,39.83 IC4.2 86.17,43.17 87,44 104,44 112.46,52.46 RCIN1.1
RCIN2
  Top 0.61: U$3.3 84.62,37.38 82.36,39.63 IC4.5 82.36,44.37 84,46 103,46 110,53 110,60 112.46,62.46 RCIN2.1
RST
  Top 0.406: U$3.1 93.09,39.91 93.75,39.25 93.75,34 | 93.75,34 93.75,32.88 99.31,27.31 99.46,27.16 101.46,25.16 JP1.5 | R3.1 93.75,34
RX1  (via drill 0.5)
  Top 0.406: R15.1 v69,81 | v61,73 58,73 52,67 v52,64 | v43,60 42,59
  Top 0.813: SV7.7 59.96,7.15 PCB2.11 59.96,26.04 44,42 44,57 42,59 41,60 19,60 18,59 17,58 15,58 13.27,59.73 SERIAL4.3
  5v 0.406: v69,81 v61,73 | v52,64 48,60 v43,60
RX2  (via drill 0.5)
  Top 0.406: R20.2 53,81 51,79 48,79 v47,78 | v43,73 43,71
  Top 0.813: U$1.3 26.05,71.05 R9.1 30.95,71.05 31,71 43,71 45,69 45,64 48,61 48,44 65,27 65,11.74 PCB2.9 64.89,11.55 SV7.9
  5v 0.406: v47,78 43,74 v43,73
RX3  (via drill 0.5)
  Top 0.406: R16.1 v61,81 | v39,66 39,64
  Top 0.813: SERIAL3.3 13.27,65.73 15,64 39,64 41,64 46,59 46,43 62.5,26.5 PCB2.10 62.35,11.55 SV7.8
  5v 0.406: v61,81 61,77 49,65 42,65 41,66 v39,66
RX4
  Top 0.406: R18.2 45,82 43,80 43,79
  Top 0.813: SV7.10 67.58,7.15 PCB2.8 67.58,27.42 50,45 50,72 43,79 19,79 16.95,81.05 14.05,81.05 13.27,80.27 SERIAL1.3
SCK  (via drill 0.5)
  Top 0.406: R13.2 77,77.25 78,76.25 78,74 82,70 92,70 96,66 96,54 v102,48 | v102,42 102,40 100.64,38.63 U$3.7 95.39,38.63 94.75,38 94.75,33.25 104,24 JP1.3
  12/3v/sig(bottom) 0.406: v102,42 v102,48
SCL
  Top 0.813: PCB2.SCL 44.72,7.15 SV7.1
  12/3v/sig(bottom) 0.813: I2C1.2 I2C2.2 I2C3.2 43.3,8.27 SV7.1
SDA
  Top 0.406: PCB2.SDA R22.2
  Top 0.813: I2C1.3 I2C2.3 I2C3.3 41.27,5.73 43,4 46,4 47,5 47,6.89 SV7.2 47.26,7.15 PCB2.SDA
SVO1  (via drill 0.5)
  Top 0.406: IC4.3 84.91,39.16 v84.75,39 | v81,37 78,37 76.72,35.72 PCB2.5
  Top 0.813: SV6.3 76.69,11.67 PCB2.5
  12/3v/sig(bottom) 0.406: v84.75,39 83,39 v81,37
SVO2
  Top 0.406: IC4.6 81.09,39.09 80,38 76,38 74.18,36.18 PCB2.6
  Top 0.813: SV6.2 74.15,11.67 PCB2.6
SVO3
  Top 0.813: PCB2.3 81.8,11.8 82,12 82,7.23 SV6.5
TX1  (via drill 0.5)
  Top 0.406: R14.2 72,81 v70,79 | v61,71 58,71 54,67 v54,64
  Top 0.813: PCB2.12 57.42,7.15 SV7.6
  5v 0.406: v70,79 69,79 v61,71 | v54,64 49,59 v44,59
  12/3v/sig(bottom) 0.406: v44,59 43,58
  12/3v/sig(bottom) 0.813: SERIAL4.2 10.73,59.27 12,58 17,58 19,60 41,60 43,58 44,57 44,42 57.42,28.58 PCB2.12
TX2  (via drill 0.5)
  Top 0.406: R21.2 56.15,79.85 57,79 57,75 56,74 v51,74
  Top 0.813: R1.2 30.95,68.95 | 30.95,68.95 31,69 | 30.95,68.95 42.05,68.95 43,68 v43,67 | SV6.4 79.23,11.67 PCB2.4
  5v 0.406: v51,74 50,74 v43,67
  12/3v/sig(bottom) 0.813: v43,67 43,66 48,61 48,44 61,31 66,31 79.26,17.74 PCB2.4
TX3  (via drill 0.5)
  Top 0.406: R17.2 64.15,80.15 v63,79
  Top 0.813: SV6.1 71.61,11.67 PCB2.7
  5v 0.406: v63,79 63,77 48,62 v39,62
  12/3v/sig(bottom) 0.406: v39,62 39,64
  12/3v/sig(bottom) 0.813: SERIAL3.2 10.73,65.27 12,64 39,64 41,64 46,59 46,43 71.64,17.36 PCB2.7
TX4  (via drill 0.5)
  Top 0.406: R19.1 46,81 v45,80 | v40.5,75.5 42,77
  Top 0.813: v48,69 48,71 42,77 39.05,76.95 18.95,76.95 18,77 11.38,77 10.73,77.64 SERIAL1.2 | SV4.3 PCB2.A3
  5v 0.406: v45,80 v40.5,75.5
  12/3v/sig(bottom) 0.813: v48,69 48,68 50,66 50,59 53,56 83,56 84.34,57.34 PCB2.A3
VCC
  Top 0.813: C1.1 94,74 IC3.3
  Top 1.016: C6.1 103,80 IC1.1 | C3.1 85,80 IC2.1
  pour 12/3v/sig(bottom) (isolate 0.254, rank 3): 79.25,81.5 83.12,77.62 90,77.62 90.88,78.75 95.86,78.75 97,77.61 97,76.36 96,75.38 93,75.38 92.5,74.75 92.5,69 93.5,68 119,68 120,69 120,87 119,88 80.25,88 79.25,87.12

### Text on the board
tPlace: Boat Interface Board V1.1 | S1 | S2 | S3 | S4 | 12V | 3.3V | 5V | (c) 2014 - David Capper | RX / TX | ROWIND | 3.3V SERIAL | VCC | I2C | MC / RC | GND | SERVOS IN | 5V SERIAL | GND | +5V | VCC | RX | TX | GND | SIG | VCC | GND | SERVOS OUT | SIG | VCC | GND | AberSailbot.co.uk | 5V I2C | GND | SCL | SDA | VCC